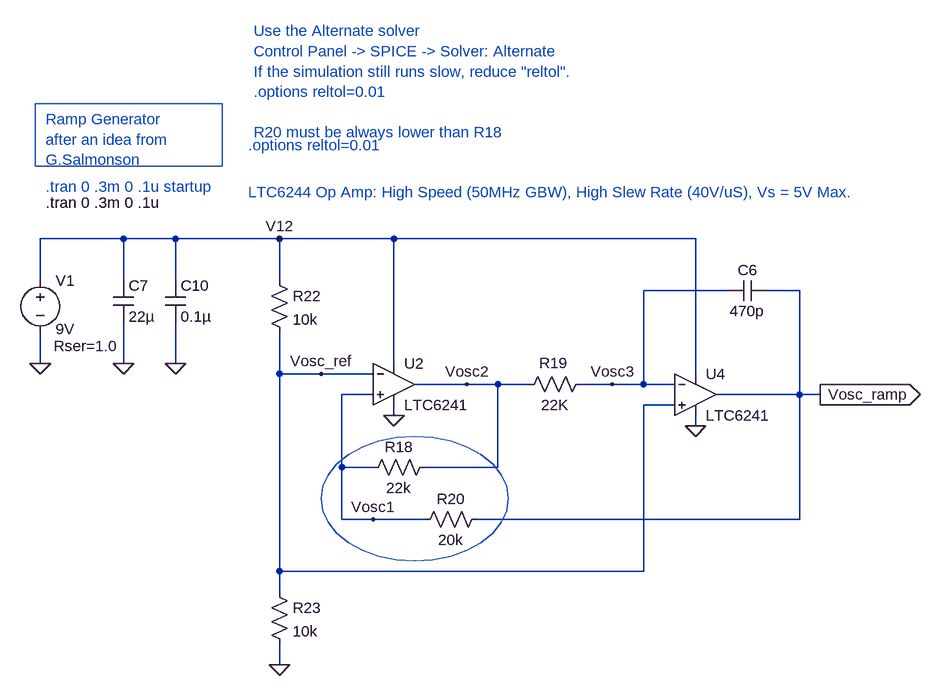
[diagram p0: schematic Ramp Generator_1.asc]
Ramp Generator_1.asc, the LTspice schematic file:
Version 4
SHEET 1 2112 680
WIRE -1312 -656 -1440 -656
WIRE -1232 -656 -1312 -656
WIRE -1072 -656 -1232 -656
WIRE -896 -656 -1072 -656
WIRE -432 -656 -896 -656
WIRE -1440 -592 -1440 -656
WIRE -1312 -592 -1312 -656
WIRE -1232 -592 -1232 -656
WIRE -1072 -592 -1072 -656
WIRE -384 -576 -512 -576
WIRE -272 -576 -320 -576
WIRE -1440 -464 -1440 -512
WIRE -1312 -464 -1312 -528
WIRE -1232 -464 -1232 -528
WIRE -896 -464 -896 -656
WIRE -1072 -448 -1072 -512
WIRE -1008 -448 -1072 -448
WIRE -928 -448 -1008 -448
WIRE -432 -448 -432 -656
WIRE -784 -432 -864 -432
WIRE -736 -432 -784 -432
WIRE -688 -432 -736 -432
WIRE -560 -432 -608 -432
WIRE -512 -432 -512 -576
WIRE -512 -432 -560 -432
WIRE -464 -432 -512 -432
WIRE -928 -416 -976 -416
WIRE -272 -416 -272 -576
WIRE -272 -416 -400 -416
WIRE -240 -416 -272 -416
WIRE -464 -400 -512 -400
WIRE -896 -384 -896 -400
WIRE -432 -368 -432 -384
WIRE -976 -304 -976 -416
WIRE -928 -304 -976 -304
WIRE -736 -304 -736 -432
WIRE -736 -304 -848 -304
WIRE -976 -224 -976 -304
WIRE -928 -224 -976 -224
WIRE -848 -224 -928 -224
WIRE -272 -224 -272 -416
WIRE -272 -224 -768 -224
WIRE -1072 -144 -1072 -448
WIRE -512 -144 -512 -400
WIRE -512 -144 -1072 -144
WIRE -1072 -112 -1072 -144
WIRE -1072 0 -1072 -32
FLAG -1440 -464 0
FLAG -1312 -464 0
FLAG -1232 -464 0
FLAG -896 -384 0
FLAG -432 -368 0
FLAG -1072 0 0
FLAG -1008 -448 Vosc_ref
FLAG -784 -432 Vosc2
FLAG -560 -432 Vosc3
FLAG -240 -416 Vosc_ramp
IOPIN -240 -416 Out
FLAG -1072 -656 V12
FLAG -928 -224 Vosc1
SYMBOL voltage -1440 -608 R0
WINDOW 123 0 0 Left 0
WINDOW 39 21 117 Left 0
WINDOW 3 24 91 Left 0
SYMATTR SpiceLine Rser=1.0
SYMATTR Value 9V
SYMATTR InstName V1
SYMBOL cap -1328 -592 R0
SYMATTR InstName C7
SYMATTR Value 22µ
SYMBOL cap -1248 -592 R0
SYMATTR InstName C10
SYMATTR Value 0.1µ
SYMBOL res -832 -320 R90
WINDOW 0 0 56 VBottom 0
WINDOW 3 32 56 VTop 0
SYMATTR InstName R18
SYMATTR Value 22k
SYMBOL res -592 -448 R90
WINDOW 0 -1 58 VBottom 0
WINDOW 3 32 56 VTop 0
SYMATTR InstName R19
SYMATTR Value 22K
SYMBOL res -752 -240 R90
WINDOW 0 0 56 VBottom 0
WINDOW 3 32 56 VTop 0
SYMATTR InstName R20
SYMATTR Value 20k
SYMBOL cap -320 -592 R90
WINDOW 0 0 32 VBottom 0
WINDOW 3 32 32 VTop 0
SYMATTR InstName C6
SYMATTR Value 470p
SYMBOL res -1088 -608 R0
SYMATTR InstName R22
SYMATTR Value 10k
SYMBOL res -1088 -128 R0
SYMATTR InstName R23
SYMATTR Value 10k
SYMBOL Opamps\\LTC6241 -896 -432 R0
SYMATTR InstName U2
SYMBOL Opamps\\LTC6241 -432 -416 R0
SYMATTR InstName U4
TEXT -1432 -712 Left 0 !.tran 0 .3m 0 .1u
TEXT -1432 -840 Left 0 ;Ramp Generator\nafter an idea from\nG.Salmonson
TEXT -1120 -728 Left 0 ;LTC6244 Op Amp: High Speed (50MHz GBW), High Slew Rate (40V/uS), Vs = 5V Max.
TEXT -1120 -800 Left 0 ;.options reltol=0.01
TEXT -1112 -976 Left 0 ;Use the Alternate solver\nControl Panel -> SPICE -> Solver: Alternate\nIf the simulation still runs slow, reduce "reltol".\n.options reltol=0.01\n \nR20 must be always lower than R18
TEXT -1432 -736 Left 0 ;.tran 0 .3m 0 .1u startup
RECTANGLE Normal -1160 -768 -1448 -864
CIRCLE Normal -720 -160 -1008 -352

The netlist it stands for:
* Ramp Generator_1.asc
V1 V12 0 9V Rser=1.0
C7 V12 0 22µ
C10 V12 0 0.1µ
R18 Vosc2 Vosc1 22k
R19 Vosc3 Vosc2 22K
R20 Vosc_ramp Vosc1 20k
C6 Vosc_ramp Vosc3 470p
R22 V12 Vosc_ref 10k
R23 Vosc_ref 0 10k
XU2 Vosc1 Vosc_ref V12 0 Vosc2 LTC6241  ; pins In+ In- V+ V- OUT
XU4 Vosc_ref Vosc3 V12 0 Vosc_ramp LTC6241  ; pins In+ In- V+ V- OUT
.tran 0 .3m 0 .1u
* Ramp Generator
* after an idea from
* G.Salmonson
* LTC6244 Op Amp: High Speed (50MHz GBW), High Slew Rate (40V/uS), Vs = 5V Max.
* .options reltol=0.01
* Use the Alternate solver
* Control Panel -> SPICE -> Solver: Alternate
* If the simulation still runs slow, reduce "reltol".
* .options reltol=0.01
* R20 must be always lower than R18
* .tran 0 .3m 0 .1u startup
.lib LTC4.lib
.backanno
.end